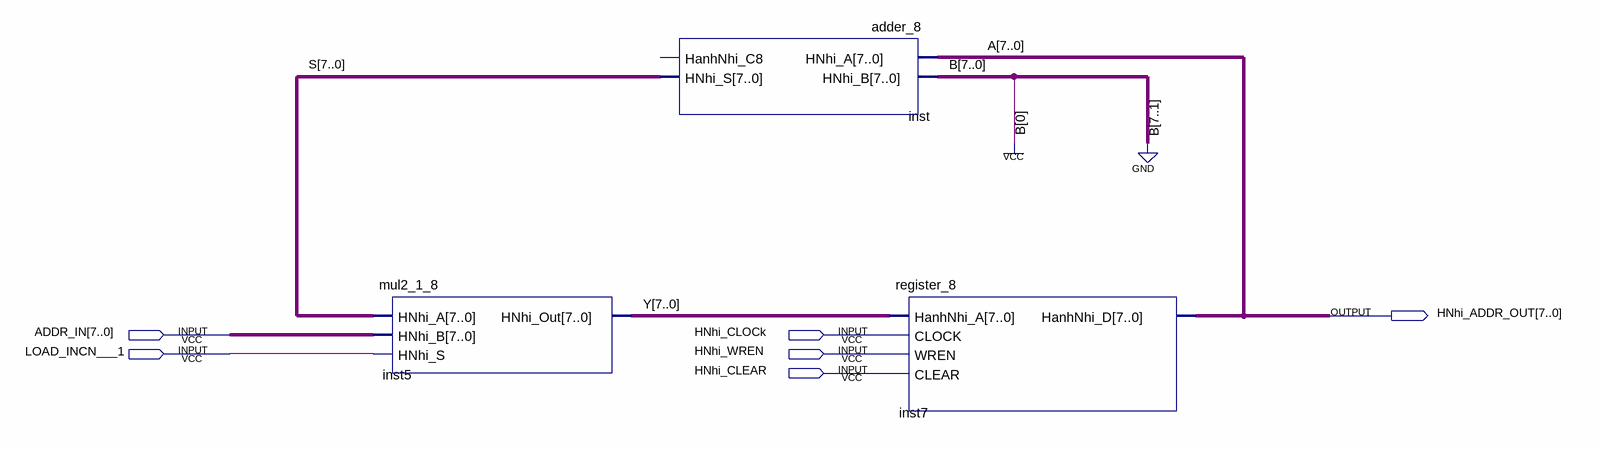
[diagram p0: schematic sheet]
// Quartus schematic program_counter.bdf as structural Verilog: 3 symbols, 6 pins
module program_counter (
  input  [7:0] ADDR_IN,
  input  HNhi_CLOCk,
  input  LOAD_INCN___1,
  input  HNhi_WREN,
  input  HNhi_CLEAR,
  output [7:0] HNhi_ADDR_OUT
);

  wire [7:0] S, Y;

  mul2_1_8 inst5 (.HNhi_A(S), .HNhi_B(ADDR_IN), .HNhi_S(LOAD_INCN___1), .HNhi_Out(Y));
  adder_8 inst (.HNhi_A(HNhi_ADDR_OUT), .HNhi_B(8'b00000001), .HNhi_S(S));  // open: HanhNhi_C8
  register_8 inst7 (.HanhNhi_A(Y), .CLOCK(HNhi_CLOCk), .WREN(HNhi_WREN), .CLEAR(HNhi_CLEAR), .HanhNhi_D(HNhi_ADDR_OUT));

  // Other names for the same wires on the sheet: A[7:0] = HNhi_ADDR_OUT
endmodule
